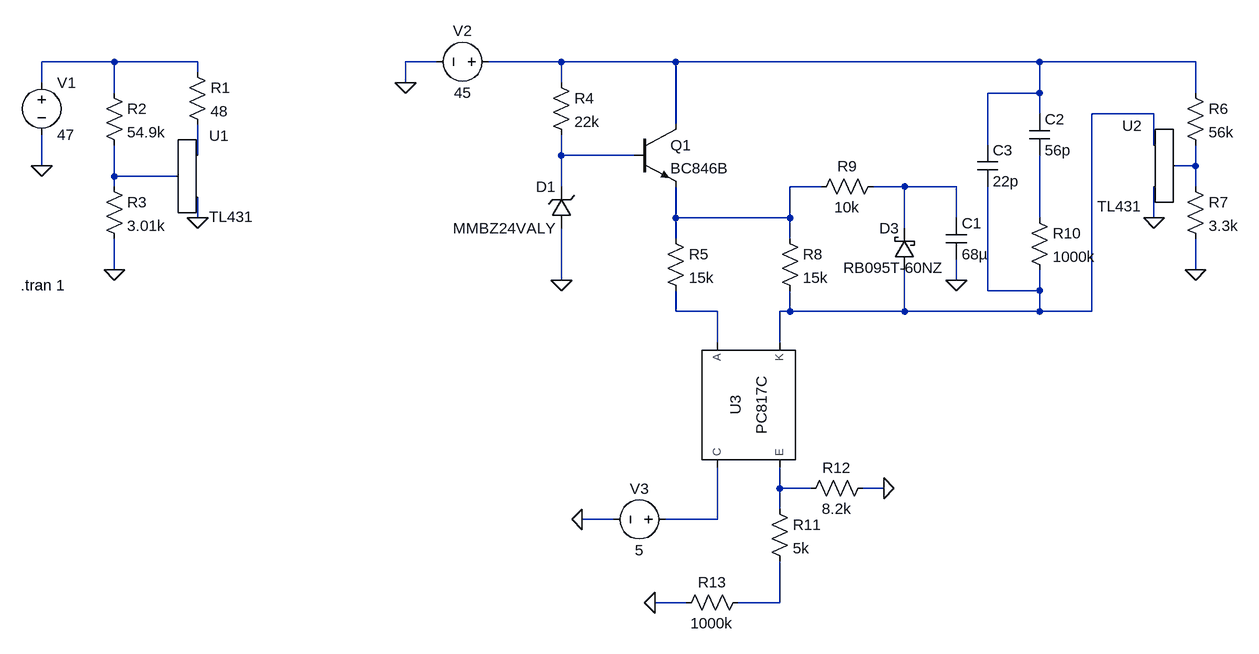
[diagram p0: schematic Draft2.asc]
Draft2.asc, the LTspice schematic file:
Version 4
SHEET 1 2244 896
WIRE 80 16 -32 16
WIRE 208 16 80 16
WIRE 576 16 528 16
WIRE 768 16 656 16
WIRE 944 16 768 16
WIRE 1504 16 944 16
WIRE 1744 16 1504 16
WIRE 208 32 208 16
WIRE -32 48 -32 16
WIRE 528 48 528 16
WIRE 768 48 768 16
WIRE 80 64 80 16
WIRE 1504 64 1504 16
WIRE 1504 64 1424 64
WIRE 1744 64 1744 16
WIRE 1504 96 1504 64
WIRE 1680 96 1584 96
WIRE 944 112 944 16
WIRE 1424 144 1424 64
WIRE 1680 144 1680 96
WIRE 208 160 208 112
WIRE 768 160 768 128
WIRE 880 160 768 160
WIRE -32 176 -32 128
WIRE 1744 176 1744 144
WIRE 1744 176 1712 176
WIRE 80 192 80 144
WIRE 176 192 80 192
WIRE 80 208 80 192
WIRE 768 208 768 160
WIRE 1168 208 1120 208
WIRE 1296 208 1248 208
WIRE 1376 208 1296 208
WIRE 1744 208 1744 176
WIRE 208 256 208 224
WIRE 944 256 944 208
WIRE 1120 256 1120 208
WIRE 1120 256 944 256
WIRE 1376 256 1376 208
WIRE 1504 256 1504 160
WIRE 1680 256 1680 208
WIRE 1296 272 1296 208
WIRE 944 288 944 256
WIRE 1120 288 1120 256
WIRE 80 336 80 288
WIRE 1744 336 1744 288
WIRE 768 352 768 272
WIRE 1376 352 1376 320
WIRE 1424 368 1424 208
WIRE 1504 368 1504 336
WIRE 1504 368 1424 368
WIRE 944 400 944 368
WIRE 1008 400 944 400
WIRE 1120 400 1120 368
WIRE 1120 400 1104 400
WIRE 1296 400 1296 336
WIRE 1296 400 1120 400
WIRE 1504 400 1504 368
WIRE 1504 400 1296 400
WIRE 1584 400 1584 96
WIRE 1584 400 1504 400
WIRE 1008 448 1008 400
WIRE 1104 448 1104 400
WIRE 1104 672 1104 640
WIRE 1152 672 1104 672
WIRE 1264 672 1232 672
WIRE 1104 704 1104 672
WIRE 848 720 800 720
WIRE 1008 720 1008 640
WIRE 1008 720 928 720
WIRE 960 848 912 848
WIRE 1104 848 1104 784
WIRE 1104 848 1040 848
FLAG 80 336 0
FLAG 208 256 0
FLAG -32 176 0
FLAG 528 48 0
FLAG 768 352 0
FLAG 1744 336 0
FLAG 1680 256 0
FLAG 1376 352 0
FLAG 1264 672 0
FLAG 800 720 0
FLAG 912 848 0
SYMBOL ZZZ\\REF\\TL431 192 160 R0
SYMATTR InstName U1
SYMBOL voltage -32 32 R0
WINDOW 123 0 0 Left 0
WINDOW 39 0 0 Left 0
SYMATTR InstName V1
SYMATTR Value 47
SYMBOL res 64 48 R0
SYMATTR InstName R2
SYMATTR Value 54.9k
SYMBOL res 64 192 R0
SYMATTR InstName R3
SYMATTR Value 3.01k
SYMBOL res 192 16 R0
SYMATTR InstName R1
SYMATTR Value 48
SYMBOL voltage 672 16 M270
WINDOW 0 32 56 VTop 2
WINDOW 3 -32 56 VBottom 2
WINDOW 123 0 0 Left 0
WINDOW 39 0 0 Left 0
SYMATTR InstName V2
SYMATTR Value 45
SYMBOL res 752 32 R0
SYMATTR InstName R4
SYMATTR Value 22k
SYMBOL zener 784 272 R180
WINDOW 0 24 64 Left 2
WINDOW 3 24 0 Left 2
SYMATTR InstName D1
SYMATTR Value MMBZ24VALY
SYMATTR Description Diode
SYMATTR Type diode
SYMBOL npn 880 112 R0
SYMATTR InstName Q1
SYMATTR Value BC846B
SYMBOL res 928 272 R0
SYMATTR InstName R5
SYMATTR Value 15k
SYMBOL res 1728 48 R0
SYMATTR InstName R6
SYMATTR Value 56k
SYMBOL res 1728 192 R0
SYMATTR InstName R7
SYMATTR Value 3.3k
SYMBOL ZZZ\\REF\\TL431 1696 144 M0
SYMATTR InstName U2
SYMBOL res 1104 272 R0
SYMATTR InstName R8
SYMATTR Value 15k
SYMBOL res 1264 192 R90
WINDOW 0 0 56 VBottom 2
WINDOW 3 32 56 VTop 2
SYMATTR InstName R9
SYMATTR Value 10k
SYMBOL schottky 1312 336 R180
WINDOW 0 24 64 Left 2
WINDOW 3 -46 3 Left 2
SYMATTR InstName D3
SYMATTR Value RB095T-60NZ
SYMATTR Description Diode
SYMATTR Type diode
SYMBOL cap 1360 256 R0
SYMATTR InstName C1
SYMATTR Value 68µ
SYMBOL res 1488 240 R0
SYMATTR InstName R10
SYMATTR Value 1000k
SYMBOL cap 1488 96 R0
SYMATTR InstName C2
SYMATTR Value 56p
SYMBOL cap 1408 144 R0
SYMATTR InstName C3
SYMATTR Value 22p
SYMBOL Optos\\PC817C 1056 544 M90
SYMATTR InstName U3
SYMBOL res 1088 688 R0
SYMATTR InstName R11
SYMATTR Value 5k
SYMBOL res 1248 656 R90
WINDOW 0 0 56 VBottom 2
WINDOW 3 32 56 VTop 2
SYMATTR InstName R12
SYMATTR Value 8.2k
SYMBOL voltage 944 720 R90
WINDOW 0 -32 56 VBottom 2
WINDOW 3 32 56 VTop 2
WINDOW 123 0 0 Left 0
WINDOW 39 0 0 Left 0
SYMATTR InstName V3
SYMATTR Value 5
SYMBOL res 1056 832 R90
WINDOW 0 0 56 VBottom 2
WINDOW 3 32 56 VTop 2
SYMATTR InstName R13
SYMATTR Value 1000k
TEXT -64 360 Left 2 !.tran 1

The netlist it stands for:
* Draft2.asc
XU1 N007 0 N004 TL431
V1 N001 0 47
R2 N001 N007 54.9k
R3 N007 0 3.01k
R1 N001 N004 48
V2 N002 0 45
R4 N002 N005 22k
D1 0 N005 MMBZ24VALY
Q1 N002 N005 N008 0 BC846B
R5 N008 N011 15k
R6 N002 N006 56k
R7 N006 0 3.3k
XU2 N006 0 N003 TL431
R8 N008 N003 15k
R9 N009 N008 10k
D3 N003 N009 RB095T-60NZ
C1 N009 0 68µ
R10 N010 N003 1000k
C2 N002 N010 56p
C3 N002 N003 22p
XU3 N011 N003 N013 N012 PC817 Igain=2.3m  ; PC817C, pins A K C E
R11 N012 N014 5k
R12 0 N012 8.2k
V3 N013 0 5
R13 N014 0 1000k
.model D D
.lib standard.dio
.model NPN NPN
.model PNP PNP
.lib standard.bjt
.tran 1
.lib TL431.mod
.lib PC817.sub
.backanno
.end